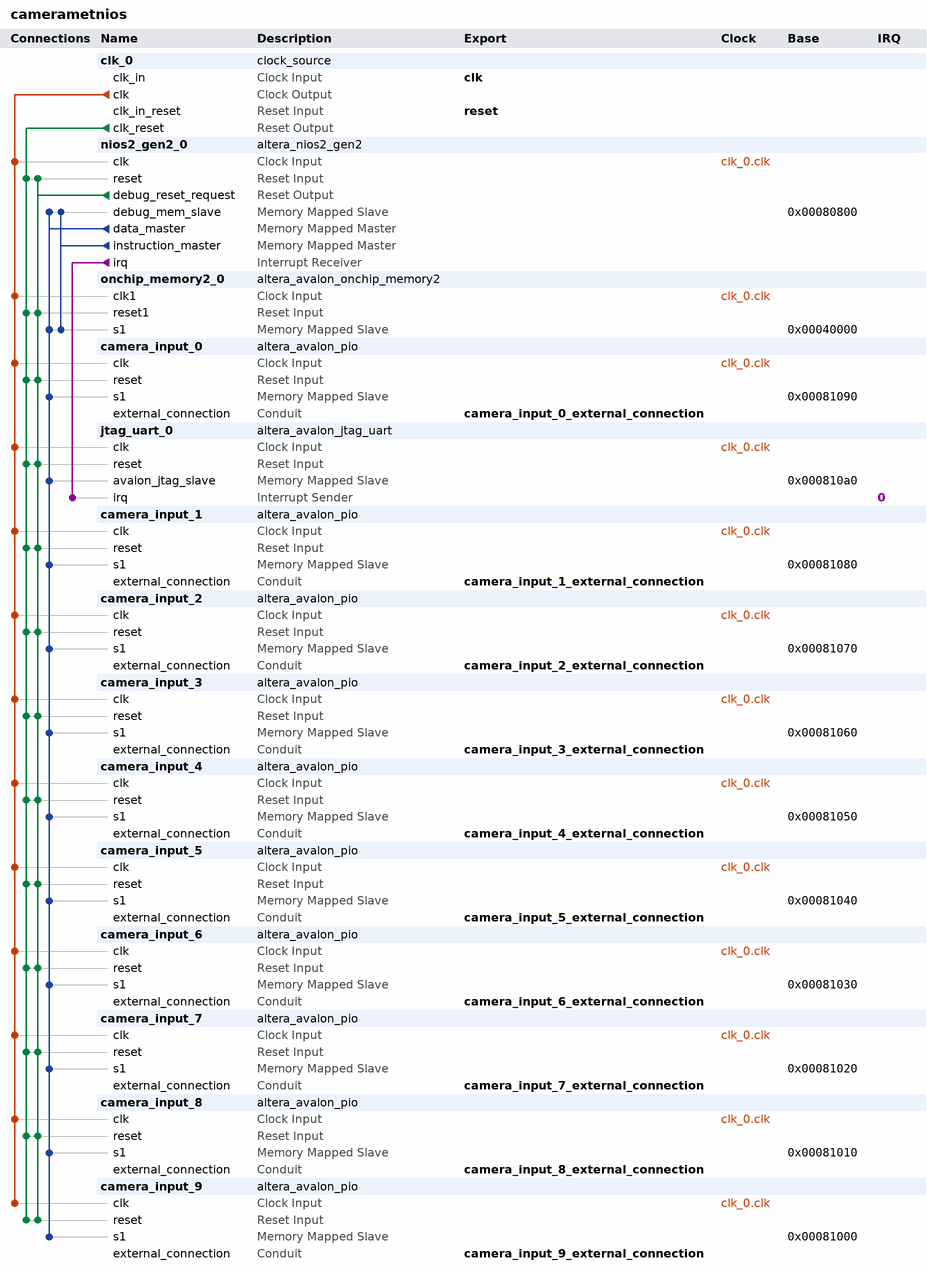
[diagram p0: system contents]
# Platform Designer (Qsys) system camerametnios, Cyclone IV E EP4CE115F29C7
# Parameters at their usual value, and those the tool derives, are not listed.
package require -exact qsys 16.1
create_system camerametnios
set_project_property DEVICE_FAMILY {Cyclone IV E}
set_project_property DEVICE EP4CE115F29C7

add_instance clk_0 clock_source 16.1
set_instance_parameter_value clk_0 clockFrequency 50000000

add_instance nios2_gen2_0 altera_nios2_gen2 16.1
set_instance_parameter_value nios2_gen2_0 dcache_size 2048
set_instance_parameter_value nios2_gen2_0 exceptionSlave onchip_memory2_0.s1
set_instance_parameter_value nios2_gen2_0 icache_size 4096
set_instance_parameter_value nios2_gen2_0 impl Fast
set_instance_parameter_value nios2_gen2_0 resetSlave onchip_memory2_0.s1

add_instance onchip_memory2_0 altera_avalon_onchip_memory2 16.1
set_instance_parameter_value onchip_memory2_0 dataWidth 32
set_instance_parameter_value onchip_memory2_0 dualPort false
set_instance_parameter_value onchip_memory2_0 initMemContent true
set_instance_parameter_value onchip_memory2_0 initializationFileName onchip_mem.hex
set_instance_parameter_value onchip_memory2_0 memorySize 262144

add_instance camera_input_0 altera_avalon_pio 16.1
set_instance_parameter_value camera_input_0 direction Input
set_instance_parameter_value camera_input_0 width 15

add_instance jtag_uart_0 altera_avalon_jtag_uart 16.1
set_instance_parameter_value jtag_uart_0 simInteractiveOptions NO_INTERACTIVE_WINDOWS

add_instance camera_input_1 altera_avalon_pio 16.1
set_instance_parameter_value camera_input_1 direction Input
set_instance_parameter_value camera_input_1 width 15

add_instance camera_input_2 altera_avalon_pio 16.1
set_instance_parameter_value camera_input_2 direction Input
set_instance_parameter_value camera_input_2 width 15

add_instance camera_input_3 altera_avalon_pio 16.1
set_instance_parameter_value camera_input_3 direction Input
set_instance_parameter_value camera_input_3 width 15

add_instance camera_input_4 altera_avalon_pio 16.1
set_instance_parameter_value camera_input_4 direction Input
set_instance_parameter_value camera_input_4 width 15

add_instance camera_input_5 altera_avalon_pio 16.1
set_instance_parameter_value camera_input_5 direction Input
set_instance_parameter_value camera_input_5 width 15

add_instance camera_input_6 altera_avalon_pio 16.1
set_instance_parameter_value camera_input_6 direction Input
set_instance_parameter_value camera_input_6 width 15

add_instance camera_input_7 altera_avalon_pio 16.1
set_instance_parameter_value camera_input_7 direction Input
set_instance_parameter_value camera_input_7 width 15

add_instance camera_input_8 altera_avalon_pio 16.1
set_instance_parameter_value camera_input_8 direction Input
set_instance_parameter_value camera_input_8 width 15

add_instance camera_input_9 altera_avalon_pio 16.1
set_instance_parameter_value camera_input_9 direction Input
set_instance_parameter_value camera_input_9 width 15

# connections
add_connection clk_0.clk camera_input_0.clk clock
add_connection clk_0.clk camera_input_1.clk clock
add_connection clk_0.clk camera_input_2.clk clock
add_connection clk_0.clk camera_input_3.clk clock
add_connection clk_0.clk camera_input_4.clk clock
add_connection clk_0.clk camera_input_5.clk clock
add_connection clk_0.clk camera_input_6.clk clock
add_connection clk_0.clk camera_input_7.clk clock
add_connection clk_0.clk camera_input_8.clk clock
add_connection clk_0.clk camera_input_9.clk clock
add_connection clk_0.clk jtag_uart_0.clk clock
add_connection clk_0.clk nios2_gen2_0.clk clock
add_connection clk_0.clk onchip_memory2_0.clk1 clock
add_connection clk_0.clk_reset camera_input_0.reset reset
add_connection clk_0.clk_reset camera_input_1.reset reset
add_connection clk_0.clk_reset camera_input_2.reset reset
add_connection clk_0.clk_reset camera_input_3.reset reset
add_connection clk_0.clk_reset camera_input_4.reset reset
add_connection clk_0.clk_reset camera_input_5.reset reset
add_connection clk_0.clk_reset camera_input_6.reset reset
add_connection clk_0.clk_reset camera_input_7.reset reset
add_connection clk_0.clk_reset camera_input_8.reset reset
add_connection clk_0.clk_reset camera_input_9.reset reset
add_connection clk_0.clk_reset jtag_uart_0.reset reset
add_connection clk_0.clk_reset nios2_gen2_0.reset reset
add_connection clk_0.clk_reset onchip_memory2_0.reset1 reset
add_connection nios2_gen2_0.debug_reset_request camera_input_0.reset reset
add_connection nios2_gen2_0.debug_reset_request camera_input_1.reset reset
add_connection nios2_gen2_0.debug_reset_request camera_input_2.reset reset
add_connection nios2_gen2_0.debug_reset_request camera_input_3.reset reset
add_connection nios2_gen2_0.debug_reset_request camera_input_4.reset reset
add_connection nios2_gen2_0.debug_reset_request camera_input_5.reset reset
add_connection nios2_gen2_0.debug_reset_request camera_input_6.reset reset
add_connection nios2_gen2_0.debug_reset_request camera_input_7.reset reset
add_connection nios2_gen2_0.debug_reset_request camera_input_8.reset reset
add_connection nios2_gen2_0.debug_reset_request camera_input_9.reset reset
add_connection nios2_gen2_0.debug_reset_request jtag_uart_0.reset reset
add_connection nios2_gen2_0.debug_reset_request nios2_gen2_0.reset reset
add_connection nios2_gen2_0.debug_reset_request onchip_memory2_0.reset1 reset
add_connection nios2_gen2_0.data_master camera_input_0.s1 avalon
set_connection_parameter_value nios2_gen2_0.data_master/camera_input_0.s1 baseAddress 0x00081090
add_connection nios2_gen2_0.data_master camera_input_1.s1 avalon
set_connection_parameter_value nios2_gen2_0.data_master/camera_input_1.s1 baseAddress 0x00081080
add_connection nios2_gen2_0.data_master camera_input_2.s1 avalon
set_connection_parameter_value nios2_gen2_0.data_master/camera_input_2.s1 baseAddress 0x00081070
add_connection nios2_gen2_0.data_master camera_input_3.s1 avalon
set_connection_parameter_value nios2_gen2_0.data_master/camera_input_3.s1 baseAddress 0x00081060
add_connection nios2_gen2_0.data_master camera_input_4.s1 avalon
set_connection_parameter_value nios2_gen2_0.data_master/camera_input_4.s1 baseAddress 0x00081050
add_connection nios2_gen2_0.data_master camera_input_5.s1 avalon
set_connection_parameter_value nios2_gen2_0.data_master/camera_input_5.s1 baseAddress 0x00081040
add_connection nios2_gen2_0.data_master camera_input_6.s1 avalon
set_connection_parameter_value nios2_gen2_0.data_master/camera_input_6.s1 baseAddress 0x00081030
add_connection nios2_gen2_0.data_master camera_input_7.s1 avalon
set_connection_parameter_value nios2_gen2_0.data_master/camera_input_7.s1 baseAddress 0x00081020
add_connection nios2_gen2_0.data_master camera_input_8.s1 avalon
set_connection_parameter_value nios2_gen2_0.data_master/camera_input_8.s1 baseAddress 0x00081010
add_connection nios2_gen2_0.data_master camera_input_9.s1 avalon
set_connection_parameter_value nios2_gen2_0.data_master/camera_input_9.s1 baseAddress 0x00081000
add_connection nios2_gen2_0.data_master jtag_uart_0.avalon_jtag_slave avalon
set_connection_parameter_value nios2_gen2_0.data_master/jtag_uart_0.avalon_jtag_slave baseAddress 0x000810a0
add_connection nios2_gen2_0.data_master nios2_gen2_0.debug_mem_slave avalon
set_connection_parameter_value nios2_gen2_0.data_master/nios2_gen2_0.debug_mem_slave baseAddress 0x00080800
add_connection nios2_gen2_0.data_master onchip_memory2_0.s1 avalon
set_connection_parameter_value nios2_gen2_0.data_master/onchip_memory2_0.s1 baseAddress 0x00040000
add_connection nios2_gen2_0.instruction_master nios2_gen2_0.debug_mem_slave avalon
set_connection_parameter_value nios2_gen2_0.instruction_master/nios2_gen2_0.debug_mem_slave baseAddress 0x00080800
add_connection nios2_gen2_0.instruction_master onchip_memory2_0.s1 avalon
set_connection_parameter_value nios2_gen2_0.instruction_master/onchip_memory2_0.s1 baseAddress 0x00040000
add_connection nios2_gen2_0.irq jtag_uart_0.irq interrupt
set_connection_parameter_value nios2_gen2_0.irq/jtag_uart_0.irq irqNumber 0

# exported interfaces
add_interface camera_input_0_external_connection conduit end
set_interface_property camera_input_0_external_connection EXPORT_OF camera_input_0.external_connection
add_interface camera_input_1_external_connection conduit end
set_interface_property camera_input_1_external_connection EXPORT_OF camera_input_1.external_connection
add_interface camera_input_2_external_connection conduit end
set_interface_property camera_input_2_external_connection EXPORT_OF camera_input_2.external_connection
add_interface camera_input_3_external_connection conduit end
set_interface_property camera_input_3_external_connection EXPORT_OF camera_input_3.external_connection
add_interface camera_input_4_external_connection conduit end
set_interface_property camera_input_4_external_connection EXPORT_OF camera_input_4.external_connection
add_interface camera_input_5_external_connection conduit end
set_interface_property camera_input_5_external_connection EXPORT_OF camera_input_5.external_connection
add_interface camera_input_6_external_connection conduit end
set_interface_property camera_input_6_external_connection EXPORT_OF camera_input_6.external_connection
add_interface camera_input_7_external_connection conduit end
set_interface_property camera_input_7_external_connection EXPORT_OF camera_input_7.external_connection
add_interface camera_input_8_external_connection conduit end
set_interface_property camera_input_8_external_connection EXPORT_OF camera_input_8.external_connection
add_interface camera_input_9_external_connection conduit end
set_interface_property camera_input_9_external_connection EXPORT_OF camera_input_9.external_connection
add_interface clk clock sink
set_interface_property clk EXPORT_OF clk_0.clk_in
add_interface reset reset sink
set_interface_property reset EXPORT_OF clk_0.clk_in_reset

set_interconnect_requirement {$system} qsys_mm.clockCrossingAdapter HANDSHAKE
set_interconnect_requirement {$system} qsys_mm.enableEccProtection FALSE
set_interconnect_requirement {$system} qsys_mm.insertDefaultSlave FALSE
set_interconnect_requirement {$system} qsys_mm.maxAdditionalLatency 1

save_system camerametnios.qsys
